# EAGLE design FHRM (EAGLE 9.5.2)
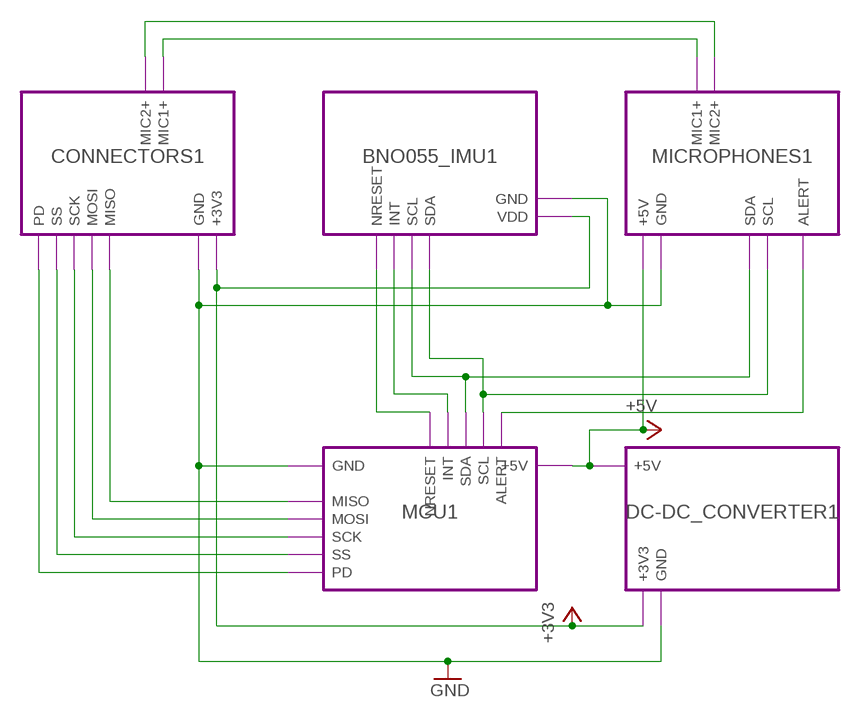
[diagram p0: schematic, sheet 1]

## Module instances
MCU1 = MCU
BNO055_IMU1 = BNO055_IMU
DC-DC_CONVERTER1 = DC-DC_CONVERTER
MICROPHONES1 = MICROPHONE
CONNECTORS1 = CONNECTORS

## Nets
+3V3: port CONNECTORS1.+3V3 BNO055_IMU1.VDD DC-DC_CONVERTER1.+3V3
+5V: port MCU1.+5V DC-DC_CONVERTER1.+5V MICROPHONES1.+5V
GND: port CONNECTORS1.GND BNO055_IMU1.GND MCU1.GND DC-DC_CONVERTER1.GND MICROPHONES1.GND
N$3: port CONNECTORS1.MISO MCU1.MISO
N$4: port CONNECTORS1.MOSI MCU1.MOSI
N$5: port CONNECTORS1.SCK MCU1.SCK
N$6: port CONNECTORS1.SS MCU1.SS
N$7: port CONNECTORS1.PD MCU1.PD
N$8: port CONNECTORS1.MIC1+ MICROPHONES1.MIC1+
N$9: port CONNECTORS1.MIC2+ MICROPHONES1.MIC2+
N$11: port MCU1.ALERT MICROPHONES1.ALERT
N$12: port MCU1.SCL MICROPHONES1.SCL BNO055_IMU1.SDA
N$13: port MCU1.SDA MICROPHONES1.SDA BNO055_IMU1.SCL
N$14: port MCU1.INT BNO055_IMU1.INT
N$15: port MCU1.NRESET BNO055_IMU1.NRESET

## Library data of the parts

## Module MCU
Ports: +5V(pwr) GND(pwr) SCL(io) SDA(io) ALERT(io) INT(io) NRESET(io) MISO(io) MOSI(io) SCK(io) SS(io) PD(io)
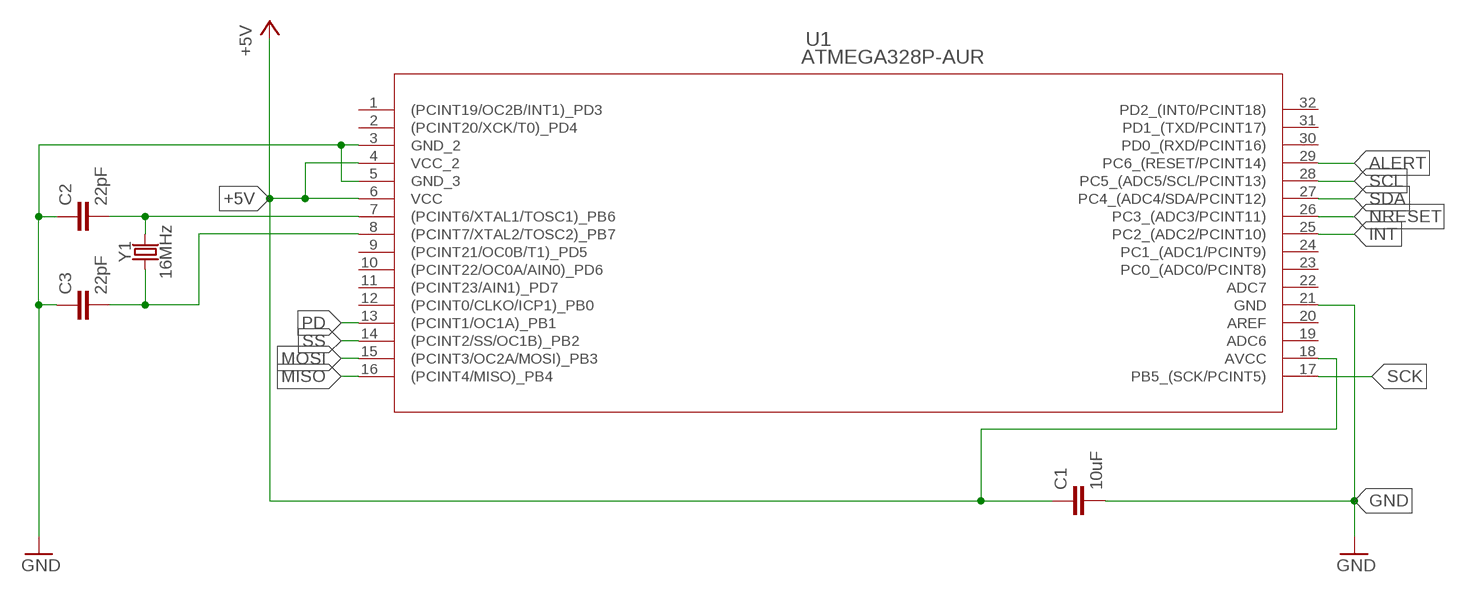
[diagram p1: schematic, module MCU, sheet 1]

### Parts
C1  10uF  10UF-0603-6.3V-20%  [0603]
C2  22pF  22PF-0603-50V-5%  [0603]
C3  22pF  22PF-0603-50V-5%  [0603]
U1  ATMEGA328P-AUR  [32A_ATM]
Y1  16MHz  CRYSTAL-16MHZSMD-5X3.2  [CRYSTAL-SMD-5X3.2-4PAD]

### Nets
+5V: C1.1 U1.4(VCC_2) U1.6(VCC) U1.18(AVCC)
ALERT: U1.29(PC6_(RESET/PCINT14))
GND: C1.2 C2.1 C3.1 U1.3(GND_2) U1.5(GND_3) U1.21(GND)
INT: U1.25(PC2_(ADC2/PCINT10))
MISO: U1.16((PCINT4/MISO)_PB4)
MOSI: U1.15((PCINT3/OC2A/MOSI)_PB3)
N$1: C2.2 U1.7((PCINT6/XTAL1/TOSC1)_PB6) Y1.3
N$2: C3.2 U1.8((PCINT7/XTAL2/TOSC2)_PB7) Y1.1
NRESET: U1.26(PC3_(ADC3/PCINT11))
PD: U1.13((PCINT1/OC1A)_PB1)
SCK: U1.17(PB5_(SCK/PCINT5))
SCL: U1.28(PC5_(ADC5/SCL/PCINT13))
SDA: U1.27(PC4_(ADC4/SDA/PCINT12))
SS: U1.14((PCINT2/SS/OC1B)_PB2)
Unconnected: U1.1((PCINT19/OC2B/INT1)_PD3) U1.2((PCINT20/XCK/T0)_PD4) U1.9((PCINT21/OC0B/T1)_PD5) U1.10((PCINT22/OC0A/AIN0)_PD6) U1.11((PCINT23/AIN1)_PD7) U1.12((PCINT0/CLKO/ICP1)_PB0) U1.19(ADC6) U1.20(AREF) U1.22(ADC7) U1.23(PC0_(ADC0/PCINT8)) U1.24(PC1_(ADC1/PCINT9)) U1.30(PD0_(RXD/PCINT16)) U1.31(PD1_(TXD/PCINT17)) U1.32(PD2_(INT0/PCINT18))

### Library data of the parts
C1 = SparkFun-Capacitors:10UF: 10.0µF ceramic capacitors A capacitor is a passive two-terminal electrical component used to store electrical energy temporarily in an electric field.; PROD_ID: CAP-11015
C2 C3 = SparkFun-Capacitors:22PF: 22pF ceramic capacitors A capacitor is a passive two-terminal electrical component used to store electrical energy temporarily in an electric field.; PROD_ID: CAP-07876
U1 = BME398_FetalHeartRate_Library:ATMEGA328P-AUR; BUILT_BY: EMA_UL_Team; MANUFACTURER_PART_NUMBER: ATMEGA328P-AUR; SOURCELIBRARY: Atmel_2014-06-19; VENDOR: Atmel
Y1 = SparkFun-Clocks:CRYSTAL-16MHZ: 16MHz Crystal Digikey Example <http://www.digikey.com/product-search/en?keywords=535-9122-1-ND> Frequency: 16MHz Frequency Stability: ±50ppm Frequency Tolerance: ±20ppm Load Capacitance: 18pF SparkFun Products: Pro Micro -5V/16MHz <https://www.sparkfun.com/products/12640> SparkFun Serial Enabled LCD Kit <https://www.sparkfun.com/products/10097>; PROD_ID: XTAL-08218; SF_ID: COM-00094

## Module BNO055_IMU
Ports: VDD(pwr) GND(pwr) SCL(io) SDA(io) NRESET(io) INT(io)
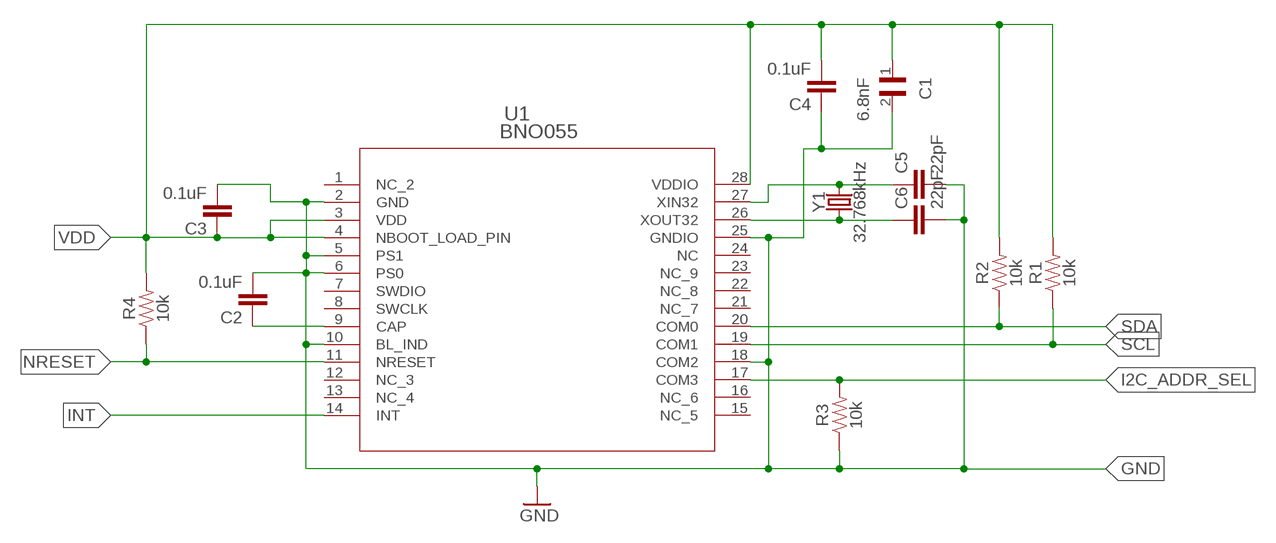
[diagram p2: schematic, module BNO055_IMU, sheet 1]

### Parts
C1  6.8nF  C0805X682J5GECAUTO7210  [CAPC2012X140N]
C2  0.1uF  0.1UF-0603-25V-(+80/-20%)  [0603]
C3  0.1uF  0.1UF-0603-25V-(+80/-20%)  [0603]
C4  0.1uF  0.1UF-0603-25V-(+80/-20%)  [0603]
C5  22pF  22PF-0603-50V-5%  [0603]
C6  22pF  22PF-0603-50V-5%  [0603]
R1  10k  10KOHM-0603-1/10W-1%  [0603]
R2  10k  10KOHM-0603-1/10W-1%  [0603]
R3  10k  10KOHM-0603-1/10W-1%  [0603]
R4  10k  10KOHM-0603-1/10W-1%  [0603]
U1  BNO055  [QFN_BNO055_BOS]
Y1  32.768kHz  CRYSTAL-32.768KHZSMD-3.2X1.5  [CRYSTAL-SMD-3.2X1.5MM]

### Nets
GND: C1.2 C2.2 C3.2 C4.1 C5.2 C6.2 R3.1 U1.2(GND) U1.5(PS1) U1.6(PS0) U1.10(BL_IND) U1.18(COM2) U1.25(GNDIO)
I2C_ADDR_SEL: R3.2 U1.17(COM3)
INT: U1.14(INT)
N$1: C5.1 U1.27(XIN32) Y1.P$2
N$2: C2.1 U1.9(CAP)
N$3: C6.1 U1.26(XOUT32) Y1.P$1
NRESET: R4.1 U1.11(NRESET)
SCL: R1.1 U1.19(COM1)
SDA: R2.1 U1.20(COM0)
VDD: C1.1 C3.1 C4.2 R1.2 R2.2 R4.2 U1.3(VDD) U1.4(NBOOT_LOAD_PIN) U1.28(VDDIO)
Unconnected: U1.1(NC_2) U1.7(SWDIO) U1.8(SWCLK) U1.12(NC_3) U1.13(NC_4) U1.15(NC_5) U1.16(NC_6) U1.21(NC_7) U1.22(NC_8) U1.23(NC_9) U1.24(NC)

### Library data of the parts
C1 = BME398_FetalHeartRate_Library:C0805X682J5GECAUTO7210; DESCRIPTION: 6800pF ±5% 50V Ceramic Capacitor C0G, NP0 0805 (2012 Metric); DIGI-KEY_PART_NUMBER: C0805X682J5GECAUTO7210-ND; MF: KEMET; MP: C0805X682J5GECAUTO7210; PACKAGE: 2012 KEMET
C2-C4 = SparkFun-Capacitors:0.1UF: 0.1µF ceramic capacitors A capacitor is a passive two-terminal electrical component used to store electrical energy temporarily in an electric field.; PROD_ID: CAP-00810
C5 C6 = SparkFun-Capacitors:22PF: 22pF ceramic capacitors A capacitor is a passive two-terminal electrical component used to store electrical energy temporarily in an electric field.; PROD_ID: CAP-07876
R1-R4 = SparkFun-Resistors:10KOHM: 10kΩ resistor A resistor is a passive two-terminal electrical component that implements electrical resistance as a circuit element. Resistors act to reduce current flow, and, at the same time, act to lower voltage levels within circuits. - Wikipedia; PROD_ID: RES-00824
U1 = BME398_FetalHeartRate_Library:BNO055; BUILT_BY: EMA_Matt; COPYRIGHT: Copyright (C) 2018 Accelerated Designs. All rights reserved; DATASHEET: https://www.bosch-sensortec.com/media/boschsensortec/downloads/datasheets/bst-bno055-ds000.pdf; MANUFACTURER_PART_NUMBER: BNO055; SOURCELIBRARY: Bosch_2019-11-06; VENDOR: Bosch
Y1 = SparkFun-Clocks:CRYSTAL-32.768KHZ: 32.768kHz Crystal Frequency: 32.768kHz Frequency Stability: ±20ppm Load Capacitance: 12.5pF (PTH-2X6 & SMD-3.2X1.5), 6pF (SMD-2X6) SparkFun Products: SparkFun BigTime Watch Kit <https://www.sparkfun.com/products/11734> SparkFun nRF52832 Breakout <https://www.sparkfun.com/products/13990> SparkFun Real Time Clock Module <https://www.sparkfun.com/products/12708>; PROD_ID: XTAL-13062

## Module DC-DC_CONVERTER
Ports: +5V(pwr) +3V3(pwr) GND(pwr)
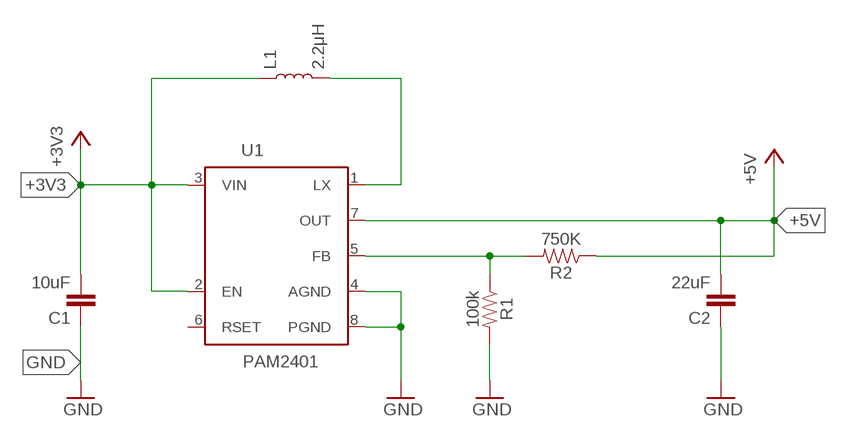
[diagram p3: schematic, module DC-DC_CONVERTER, sheet 1]

### Parts
C1  10uF  10UF-0603-6.3V-20%  [0603]
C2  22uF  22UF-0603-6.3V-20%  [0603]
L1  2.2μH  2.2μH-0805_WIDE-2.2μH-1.7A-0.14OHM  [0805-WIDE]
R1  100k  100KOHM-0603-1/10W-1%  [0603]
R2  750K  750KOHM-0603-1/10W-1%  [0603]
U1  PAM2401  [MSOP8]

### Nets
+3V3: C1.2 L1.1 U1.2(EN) U1.3(VIN)
+5V: C2.2 R2.1 U1.7(OUT)
GND: C1.1 C2.1 R1.2 U1.4(AGND) U1.8(PGND)
N$1: L1.2 U1.1(LX)
N$2: R1.1 R2.2 U1.5(FB)
Unconnected: U1.6(RSET)

### Library data of the parts
C1 = SparkFun-Capacitors:10UF: 10.0µF ceramic capacitors A capacitor is a passive two-terminal electrical component used to store electrical energy temporarily in an electric field.; PROD_ID: CAP-11015
C2 = SparkFun-Capacitors:22UF: 22µF ceramic capacitors A capacitor is a passive two-terminal electrical component used to store electrical energy temporarily in an electric field.; PROD_ID: CAP-14464
L1 = SparkFun-Coils:2.2μH: 2.2μH Inductor Resist changes in electrical current. Basically a coil of wire. SparkFun Products: SparkFun Edge - HX711 <https://www.sparkfun.com/products/15170>; PROD_ID: NDUC-14234
R1 = SparkFun-Resistors:100KOHM: 100kΩ resistor A resistor is a passive two-terminal electrical component that implements electrical resistance as a circuit element. Resistors act to reduce current flow, and, at the same time, act to lower voltage levels within circuits. - Wikipedia; PROD_ID: RES-07828
R2 = SparkFun-Resistors:750KOHM: 750Ω resistor A resistor is a passive two-terminal electrical component that implements electrical resistance as a circuit element. Resistors act to reduce current flow, and, at the same time, act to lower voltage levels within circuits. - Wikipedia; PROD_ID: RES-13768
U1 = SparkFun-IC-Power:PAM2401: PAM2401 - Boost PMIC Specifications: Up to 1A output current 0.9V to 4.75V Input Range 2.5V to 5.0V Adjustable Output Voltage Datasheet <https://www.diodes.com/assets/Datasheets/PAM2401.pdf> (Diodes inc.); PROD_ID: IC-13769

## Module MICROPHONE
Ports: +5V(pwr) GND(pwr) MIC1+(io) MIC2+(io) ALERT(io) SCL(io) SDA(io)
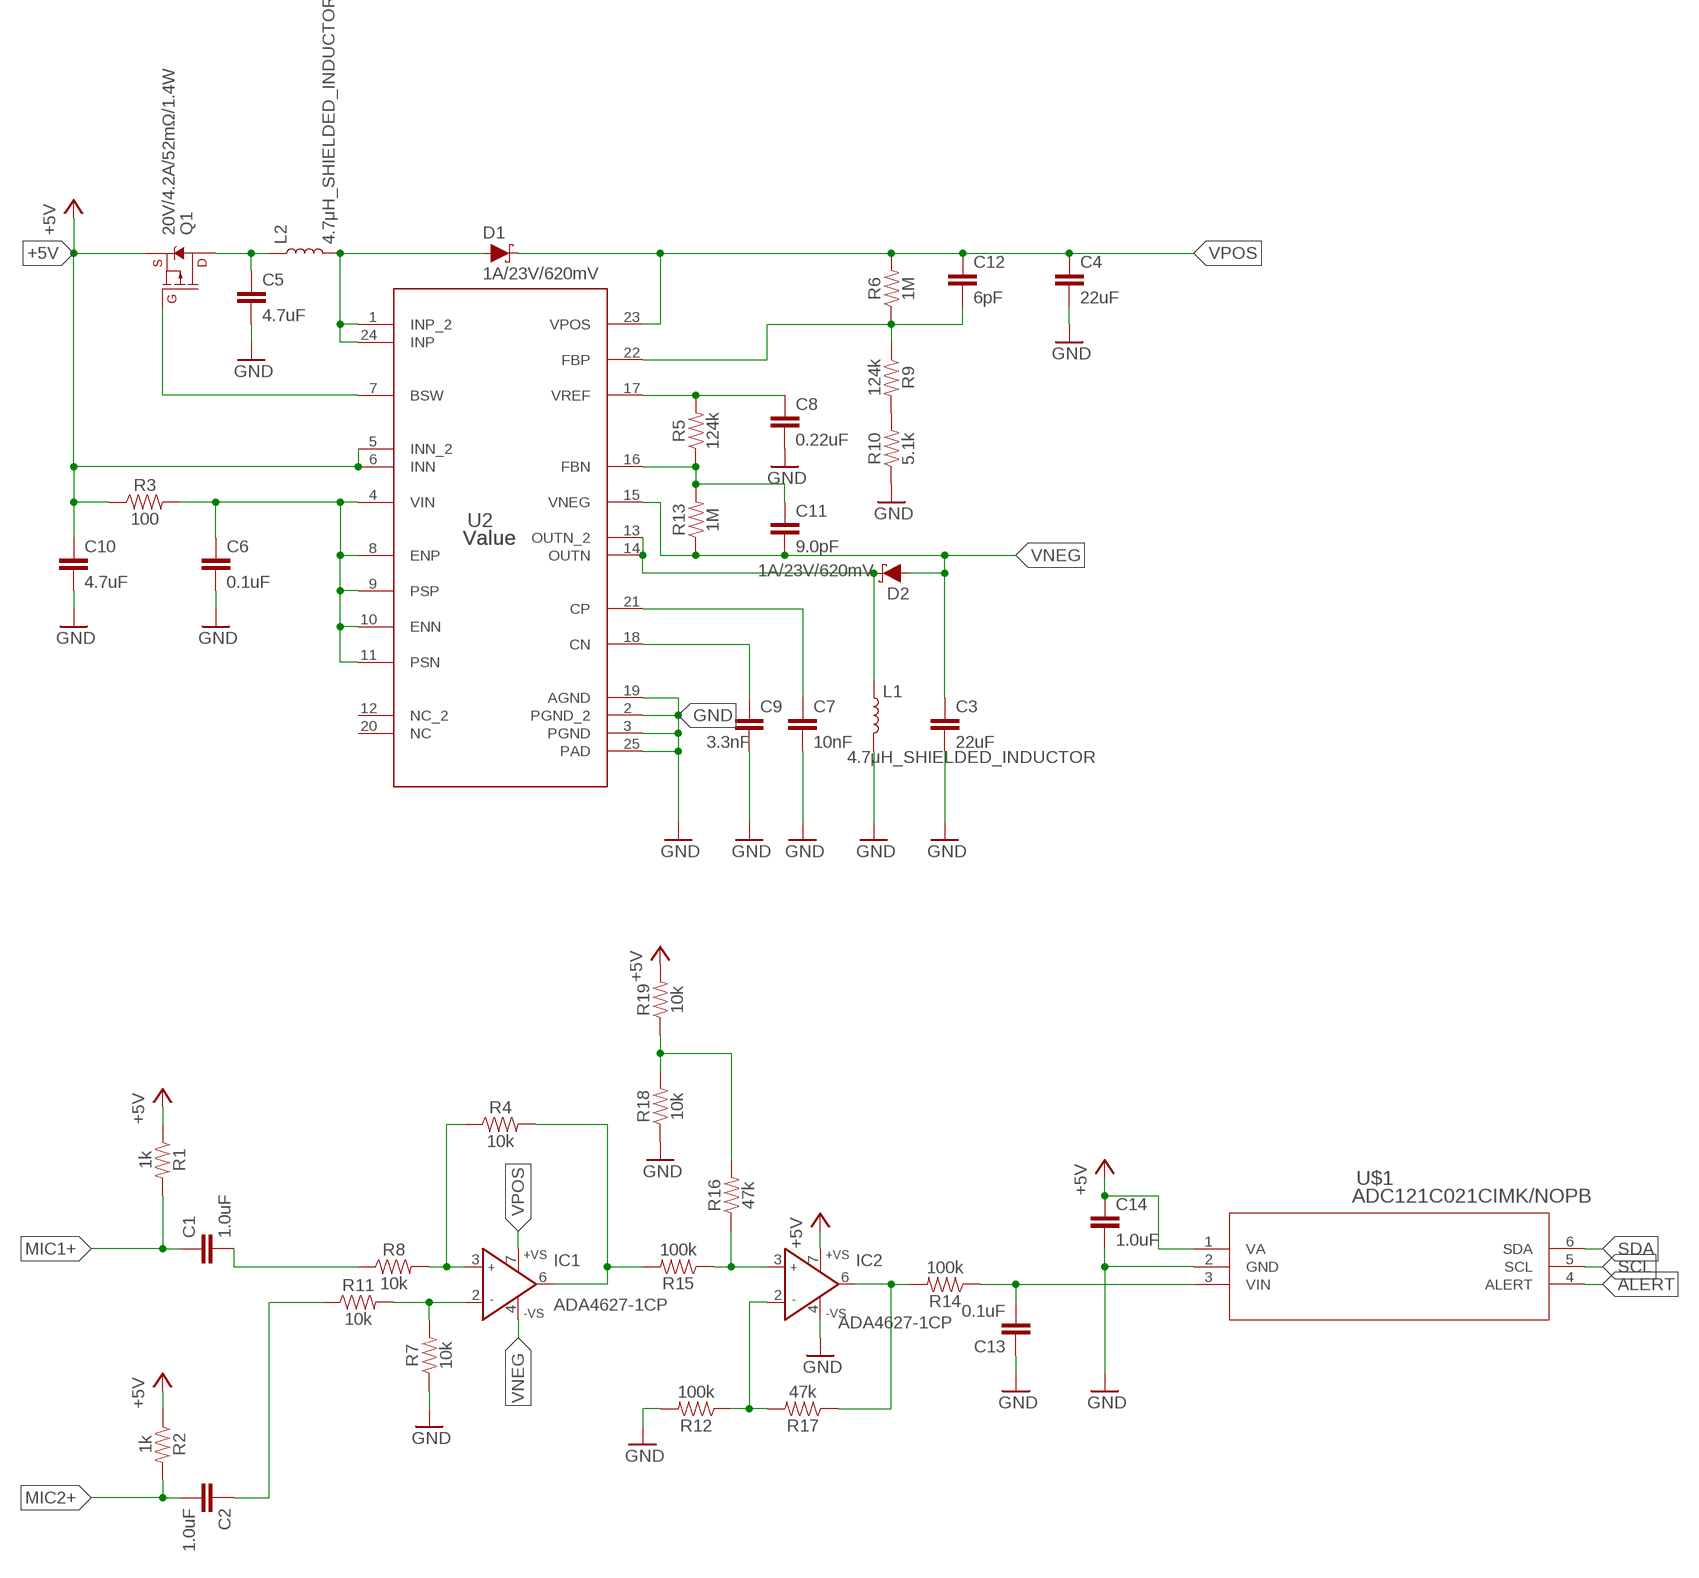
[diagram p4: schematic, module MICROPHONE, sheet 1]

### Parts
C1  1.0uF  1.0UF-0603-16V-10%  [0603]
C2  1.0uF  1.0UF-0603-16V-10%  [0603]
C3  22uF  22UF-0805-16V-20%  [0805]
C4  22uF  22UF-0805-16V-20%  [0805]
C5  4.7uF  4.7UF-0603-6.3V-(10%)  [0603]
C6  0.1uF  0.1UF-0603-25V-(+80/-20%)  [0603]
C7  10nF  10NF-0603-50V-10%  [0603]
C8  0.22uF  0.22UF-0603-25V-10%  [0603]
C9  3.3nF  3.3NF-0603-100V-10%  [0603]
C10  4.7uF  4.7UF-0603-6.3V-(10%)  [0603]
C11  9.0pF  9.0PF-0603-50V-10%  [0603]
C12  6pF  6PF-0402-50V-0.5%  [0402]
C13  0.1uF  0.1UF-0603-25V-(+80/-20%)  [0603]
C14  1.0uF  1.0UF-0603-16V-10%  [0603]
D1  1A/23V/620mV  DIODE-SCHOTTKY-BAT20J  [SOD-323]
D2  1A/23V/620mV  DIODE-SCHOTTKY-BAT20J  [SOD-323]
IC1  ADA4627-1CP  [LFCSP8]
IC2  ADA4627-1CP  [LFCSP8]
L1  4.7μH_SHIELDED_INDUCTOR  [1008(2520)]
L2  4.7μH_SHIELDED_INDUCTOR  [1008(2520)]
Q1  20V/4.2A/52mΩ/1.4W  MOSFET_PCH-DMG2305UX-7  [SOT23-3]
R1  1k  1KOHM-0603-1/10W-1%  [0603]
R2  1k  1KOHM-0603-1/10W-1%  [0603]
R3  100  100OHM-0603-1/10W-1%  [0603]
R4  10k  10KOHM-0603-1/10W-1%  [0603]
R5  124k  124KOHM  [0603]
R6  1M  1MOHM-0603-1/4W-5%  [0603]
R7  10k  10KOHM-0603-1/10W-1%  [0603]
R8  10k  10KOHM-0603-1/10W-1%  [0603]
R9  124k  124KOHM  [0603]
R10  5.1k  5.1KOHM5.1KOHM-0603-1/10W-1%  [0603]
R11  10k  10KOHM-0603-1/10W-1%  [0603]
R12  100k  100KOHM-0603-1/10W-1%  [0603]
R13  1M  1MOHM-0603-1/4W-5%  [0603]
R14  100k  100KOHM-0603-1/10W-1%  [0603]
R15  100k  100KOHM-0603-1/10W-1%  [0603]
R16  47k  47KOHM-0603-1/10W-1%  [0603]
R17  47k  47KOHM-0603-1/10W-1%  [0603]
R18  10k  10KOHM-0603-1/10W-1%  [0603]
R19  10k  10KOHM-0603-1/10W-1%  [0603]
U2  Value  TPS65130RGER  [RGE0024B]
U$1  ADC121C021CIMK/NOPB  [MK06A]

### Nets
+5V: C10.1 C14.1 IC2.7(+VS) Q1.2(S) R1.1 R2.1 R3.1 R19.2 U2.5(INN_2) U2.6(INN) U$1.1(VA)
ALERT: U$1.4(ALERT)
GND: C3.2 C4.2 C5.2 C6.2 C7.2 C8.2 C9.2 C10.2 C13.1 C14.2 IC2.4(-VS) L1.2 R7.1 R10.1 R12.2 R18.1 U2.2(PGND_2) U2.3(PGND) U2.19(AGND) U2.25(PAD) U$1.2(GND)
MIC1+: C1.1 R1.2
MIC2+: C2.2 R2.2
N$1: C6.1 R3.2 U2.4(VIN) U2.8(ENP) U2.9(PSP) U2.10(ENN) U2.11(PSN)
N$2: C7.1 U2.21(CP)
N$3: C9.1 U2.18(CN)
N$4: Q1.1(G) U2.7(BSW)
N$5: C5.1 L2.1 Q1.3(D)
N$6: D1.A L2.2 U2.1(INP_2) U2.24(INP)
N$7: IC2.3(IN+) R15.1 R16.1
N$8: C8.1 R5.2 U2.17(VREF)
N$9: C11.1 R5.1 R13.2 U2.16(FBN)
N$10: IC2.2(IN-) R12.1 R17.2
N$11: D2.C L1.1 U2.13(OUTN_2) U2.14(OUTN)
N$12: R9.2 R10.2
N$13: C12.2 R6.1 R9.1 U2.22(FBP)
N$14: C1.2 R8.1
N$15: C2.1 R11.1
N$16: IC1.2(IN-) R7.2 R11.2
N$17: IC1.3(IN+) R4.1 R8.2
N$18: IC1.6(OUT) R4.2 R15.2
N$19: IC2.6(OUT) R14.2 R17.1
N$20: C13.2 R14.1 U$1.3(VIN)
N$21: R16.2 R18.2 R19.1
SCL: U$1.5(SCL)
SDA: U$1.6(SDA)
VNEG: C3.1 C11.2 D2.A IC1.4(-VS) R13.1 U2.15(VNEG)
VPOS: C4.1 C12.1 D1.C IC1.7(+VS) R6.2 U2.23(VPOS)
Unconnected: U2.12(NC_2) U2.20(NC)

### Library data of the parts
C1 C2 C14 = SparkFun-Capacitors:1.0UF: 1µF ceramic capacitors A capacitor is a passive two-terminal electrical component used to store electrical energy temporarily in an electric field.; PROD_ID: CAP-00868
C3 C4 = SparkFun-Capacitors:22UF: 22µF ceramic capacitors A capacitor is a passive two-terminal electrical component used to store electrical energy temporarily in an electric field.; PROD_ID: CAP-14260
C5 C10 = SparkFun-Capacitors:4.7UF: 4.7µF ceramic capacitors A capacitor is a passive two-terminal electrical component used to store electrical energy temporarily in an electric field.; PROD_ID: CAP-08280
C6 C13 = SparkFun-Capacitors:0.1UF: 0.1µF ceramic capacitors A capacitor is a passive two-terminal electrical component used to store electrical energy temporarily in an electric field.; PROD_ID: CAP-00810
C7 = SparkFun-Capacitors:10NF: 0.01uF/10nF/10,000pF ceramic capacitors A capacitor is a passive two-terminal electrical component used to store electrical energy temporarily in an electric field. CAP-09321; PROD_ID: CAP-00867
C8 = SparkFun-Capacitors:0.22UF: 0.22µF ceramic capacitors A capacitor is a passive two-terminal electrical component used to store electrical energy temporarily in an electric field.; PROD_ID: CAP-07822
C9 = SparkFun-Capacitors:3.3NF: 3.3nF ceramic capacitors A capacitor is a passive two-terminal electrical component used to store electrical energy temporarily in an electric field.; PROD_ID: CAP-09633
C11 = SparkFun-Capacitors:9.0PF: 9.0pF ceramic capacitors A capacitor is a passive two-terminal electrical component used to store electrical energy temporarily in an electric field.; PROD_ID: CAP-09341
C12 = SparkFun-Capacitors:6PF: 6pF ceramic capacitors A capacitor is a passive two-terminal electrical component used to store electrical energy temporarily in an electric field.; PROD_ID: CAP-13455
D1 D2 = SparkFun-DiscreteSemi:DIODE-SCHOTTKY: Schottky diode A Schottky diode is a semiconductor diode which has a low forward voltage drop and a very fast switching action.; PROD_ID: DIO-11623
IC1 IC2 = analog-devices:ADA4627-1CP: 36 V, 19 MHz, Low Noise, Low Bias Current, JFET Operational Amplifier Source: http://www.analog.com/static/imported-files/data_sheets/ADA4627-1.pdf; MPN: ADA4627-1ACPZ-R2; OC_FARNELL: 1827379; OC_NEWARK: 80R8148
L1 L2 = SparkFun-Coils:4.7μH_SHIELDED_INDUCTOR: 4.7uH Inductor 4.7uH 1.4A 50mOhm 1008(2520) Package Shielded; PROD_ID: NDUC-14880
Q1 = SparkFun-DiscreteSemi:MOSFET_PCH: P-channel MOSFETs Voltage controlled devices that allow control of high current outputs. SparkFun Products: SparkFun ESP32 Thing <https://www.sparkfun.com/products/13907> SparkFun ESP8266 Thing <https://www.sparkfun.com/products/13231> SparkFun Pi Servo HAT V2 <https://www.sparkfun.com/products/15316> DMG2305UX-7 (20V/4.2A/SOT23-3); PROD_ID: TRAN-14388
R1 R2 = SparkFun-Resistors:1KOHM: 1kΩ resistor A resistor is a passive two-terminal electrical component that implements electrical resistance as a circuit element. Resistors act to reduce current flow, and, at the same time, act to lower voltage levels within circuits. - Wikipedia; PROD_ID: RES-07856
R3 = SparkFun-Resistors:100OHM: 100Ω resistor A resistor is a passive two-terminal electrical component that implements electrical resistance as a circuit element. Resistors act to reduce current flow, and, at the same time, act to lower voltage levels within circuits. - Wikipedia; PROD_ID: RES-07863
R4 R7 R8 R11 R18 R19 = SparkFun-Resistors:10KOHM: 10kΩ resistor A resistor is a passive two-terminal electrical component that implements electrical resistance as a circuit element. Resistors act to reduce current flow, and, at the same time, act to lower voltage levels within circuits. - Wikipedia; PROD_ID: RES-00824
R5 R9 = SparkFun-Resistors:124KOHM: 124kΩ resistor A resistor is a passive two-terminal electrical component that implements electrical resistance as a circuit element. Resistors act to reduce current flow, and, at the same time, act to lower voltage levels within circuits. - Wikipedia; PROD_ID: RES-14395
R6 R13 = SparkFun-Resistors:1MOHM: 1MΩ resistor A resistor is a passive two-terminal electrical component that implements electrical resistance as a circuit element. Resistors act to reduce current flow, and, at the same time, act to lower voltage levels within circuits. - Wikipedia; PROD_ID: RES-07868
R10 = SparkFun-Resistors:5.1KOHM; PROD_ID: RES-12083
R12 R14 R15 = SparkFun-Resistors:100KOHM: 100kΩ resistor A resistor is a passive two-terminal electrical component that implements electrical resistance as a circuit element. Resistors act to reduce current flow, and, at the same time, act to lower voltage levels within circuits. - Wikipedia; PROD_ID: RES-07828
R16 R17 = SparkFun-Resistors:47KOHM: 47kΩ resistor A resistor is a passive two-terminal electrical component that implements electrical resistance as a circuit element. Resistors act to reduce current flow, and, at the same time, act to lower voltage levels within circuits. - Wikipedia; PROD_ID: RES-07871
U2 = BME398_FetalHeartRate_Library:TPS65130RGER; ALTERNATE_PARTNUMBER: TPS65130RGET; APPLICATION_BUILDNUMBER: *; COMPTYPE: IC; MANUFACTURER: Texas Instruments; MOUNTTYPE: SMT; PACKAGEREFERENCE: RGE0024B; PARTNUMBER: TPS65130RGER; PIN_COUNT: 25; REFDES: RefDes; ROHS: Y; TYPE: TYPE
U$1 = BME398_FetalHeartRate_Library:ADC121C021CIMK/NOPB; MANUFACTURER_PART_NUMBER: ADC121C021CIMK/NOPB; VENDOR: National

## Module CONNECTORS
Ports: +3V3(pwr) GND(pwr) MIC1+(io) MIC2+(io) MISO(io) MOSI(io) SCK(io) SS(io) PD(io)
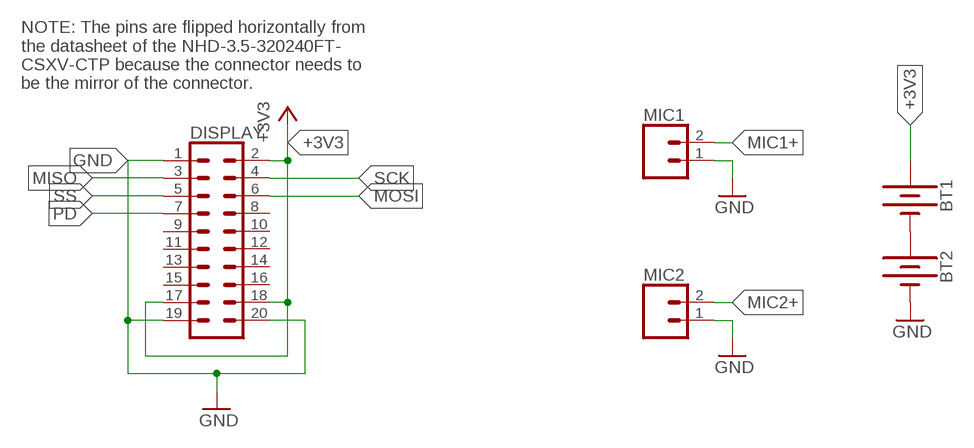
[diagram p5: schematic, module CONNECTORS, sheet 1]

### Parts
BT1  BATTERY-AA  [BATTERY-AA]
BT2  BATTERY-AA  [BATTERY-AA]
DISPLAY  CONN_10X2  [2X10]
MIC1  CONN_02JST-PTH-2  [JST-2-PTH]
MIC2  CONN_02JST-PTH-2  [JST-2-PTH]

### Nets
+3V3: BT1.PWR@1(+) DISPLAY.2 DISPLAY.17 DISPLAY.18
GND: BT2.GND@1(-) DISPLAY.1 DISPLAY.19 DISPLAY.20 MIC1.1 MIC2.1
MIC1+: MIC1.2
MIC2+: MIC2.2
MISO: DISPLAY.3
MOSI: DISPLAY.6
N$1: BT1.GND@1(-) BT2.PWR@1(+)
PD: DISPLAY.7
SCK: DISPLAY.4
SS: DISPLAY.5
Unconnected: DISPLAY.8 DISPLAY.9 DISPLAY.10 DISPLAY.11 DISPLAY.12 DISPLAY.13 DISPLAY.14 DISPLAY.15 DISPLAY.16

### Notes on the sheet
- NOTE: The pins are flipped horizontally from
  the datasheet of the NHD-3.5-320240FT-
  CSXV-CTP because the connector needs to 
  be the mirror of the connector.

### Library data of the parts
BT1 BT2 = SparkFun-Batteries:BATTERY: Battery - Single Cell A variety of battery chemistries, sizes, and footprints. Device List: 20MM_PTH - Coin Cell Battery Holder - 20mm (PTH) <https://www.sparkfun.com/products/783> 20MM_PTH_KIT- Coin Cell battery Holder - 20 mm (PTH) <http://www.sparkfun.com/products/783>kit version with special mask 6.8MM_PTH - Coin Cell Battery Holder - 6.8MM(SMD) <https://www.digikey.com/product-detail/en/seiko-instruments/MS621FE-FL11E/728-1057-ND/1889208?WT.srch=1&gclid=CNOQ5a6LzdQCFZS2wAodXCkE0g> 12MM_SMD - Coin Cell Battery Holder - 12mm (SMD) <https://www.sparkfun.com/products/10592> 12MM_PTH - Coin Cell Battery Holder - 12mm (PTH) <https://www.sparkfun.com/products/7948> 20MM_SMD - 20mm Coin Cell Battery Holder (SMD) (2 legs) Used on the Big Time Watch Kit <https://www.sparkfun.com/products/11734> 20MM_SMD_4LEGS - Coin Cell Battery Holder - 20mm (SMD) <https://www.sparkfun.com/products/11892> 20MM_SMD_4LEGS_OVERPASTE - Coin Cell Battery Holder - 20mm (SMD) <https://www.sparkfun.com/products/11892> (Over-paste on the legs) 24.5MM_PTH - Coin Cell Battery Holder - 24.5mm (PTH) <https://www.sparkfun.com/products/8863> 9V - 9V Battery Holder - PC Mount Used on the SparkFun SparkPunk Sound Kit <https://www.sparkfun.com/products/11177> and SparkFun SparkPunk Sequencer Kit <https://www.sparkfun.com/products/12707> 18650 - Battery Holder - 18650 (PTH) <https://www.sparkfun.com/products/13113> AA - Battery Holder - 1xAA (PTH) <https://www.sparkfun.com/products/7949> AAA - Battery Holder - 1xAAA (PTH) <https://www.sparkfun.com/products/12718> AA_KIT - Battery Holder - 1xAA (PTH) <https://www.sparkfun.com/products/7949> Special kit package - pads only have exposed copper on one side of the board. AAA_KIT - Battery Holder - 1xAAA (PTH) <https://www.sparkfun.com/products/12718> Special kit package - pads only have exposed copper on one side of the board.; PROD_ID: BATT-08316; SF_SKU: PRT-07949
DISPLAY = SparkFun-Connectors:CONN_10X2: Multi connection point. Often used as Generic Header-pin footprint for 0.1 inch spaced/style header connections On any of the 0.1 inch spaced packages, you can populate with these: Break Away Headers - Straight <https://www.sparkfun.com/products/116> (PRT-00116) Break Away Male Headers - Right Angle <https://www.sparkfun.com/products/553> (PRT-00553) Female Headers <https://www.sparkfun.com/products/115> (PRT-00115) Break Away Headers - Machine Pin <https://www.sparkfun.com/products/117> (PRT-00117) Break Away Female Headers - Swiss Machine Pin <https://www.sparkfun.com/products/743> (PRT-00743) Special note about the "SPECIAL" package: This was SPECIALLY designed to be used with our Graphic LCD Backpack. Be sure you want to use this! It is not only staggered on each line of header holes, but IT IS ALSO offset of the center point of the top and bottom lines by 5 mil. This causes the headers to lock into place on the "standard" footprint on the LCD screen. The extra squares on the tdocu layer are there simply to reference other pins (if you were to actually populate a longer header than ten long - this is what we do with the backpacks).
MIC1 MIC2 = SparkFun-Connectors:CONN_02: Multi connection point. Often used as Generic Header-pin footprint for 0.1 inch spaced/style header connections On any of the 0.1 inch spaced packages, you can populate with these: Break Away Headers - Straight <https://www.sparkfun.com/products/116> (PRT-00116) Break Away Male Headers - Right Angle <https://www.sparkfun.com/products/553> (PRT-00553) Female Headers <https://www.sparkfun.com/products/115> (PRT-00115) Break Away Headers - Machine Pin <https://www.sparkfun.com/products/117> (PRT-00117) Break Away Female Headers - Swiss Machine Pin <https://www.sparkfun.com/products/743> (PRT-00743) For SCREWTERMINALS and SPRING TERMINALS visit here: Screw Terimnals on SparkFun.com <https://www.sparkfun.com/search/results?term=Screw+Terminals> (5mm/3.5mm/2.54mm spacing) This device is also useful as a general connection point to wire up your design to another part of your project. Our various solder wires solder well into these plated through hole pads. Hook-Up Wire - Assortment (Stranded, 22 AWG) <https://www.sparkfun.com/products/11375> (PRT-11375) Hook-Up Wire - Assortment (Solid Core, 22 AWG) <https://www.sparkfun.com/products/11367> (PRT-11367) View the entire wire category on our website here <https://www.sparkfun.com/categories/141> Special notes: Molex polarized connector foot print use with: PRT-08233 with associated crimp pins and housings. 2.54_SCREWTERM for use with PRT-10571. 3.5mm Screw Terminal footprints for PRT-08084 5mm Screw Terminal footprints for use with PRT-08432; PROD_ID: CONN-09863; SKU: PRT-09914

## Board
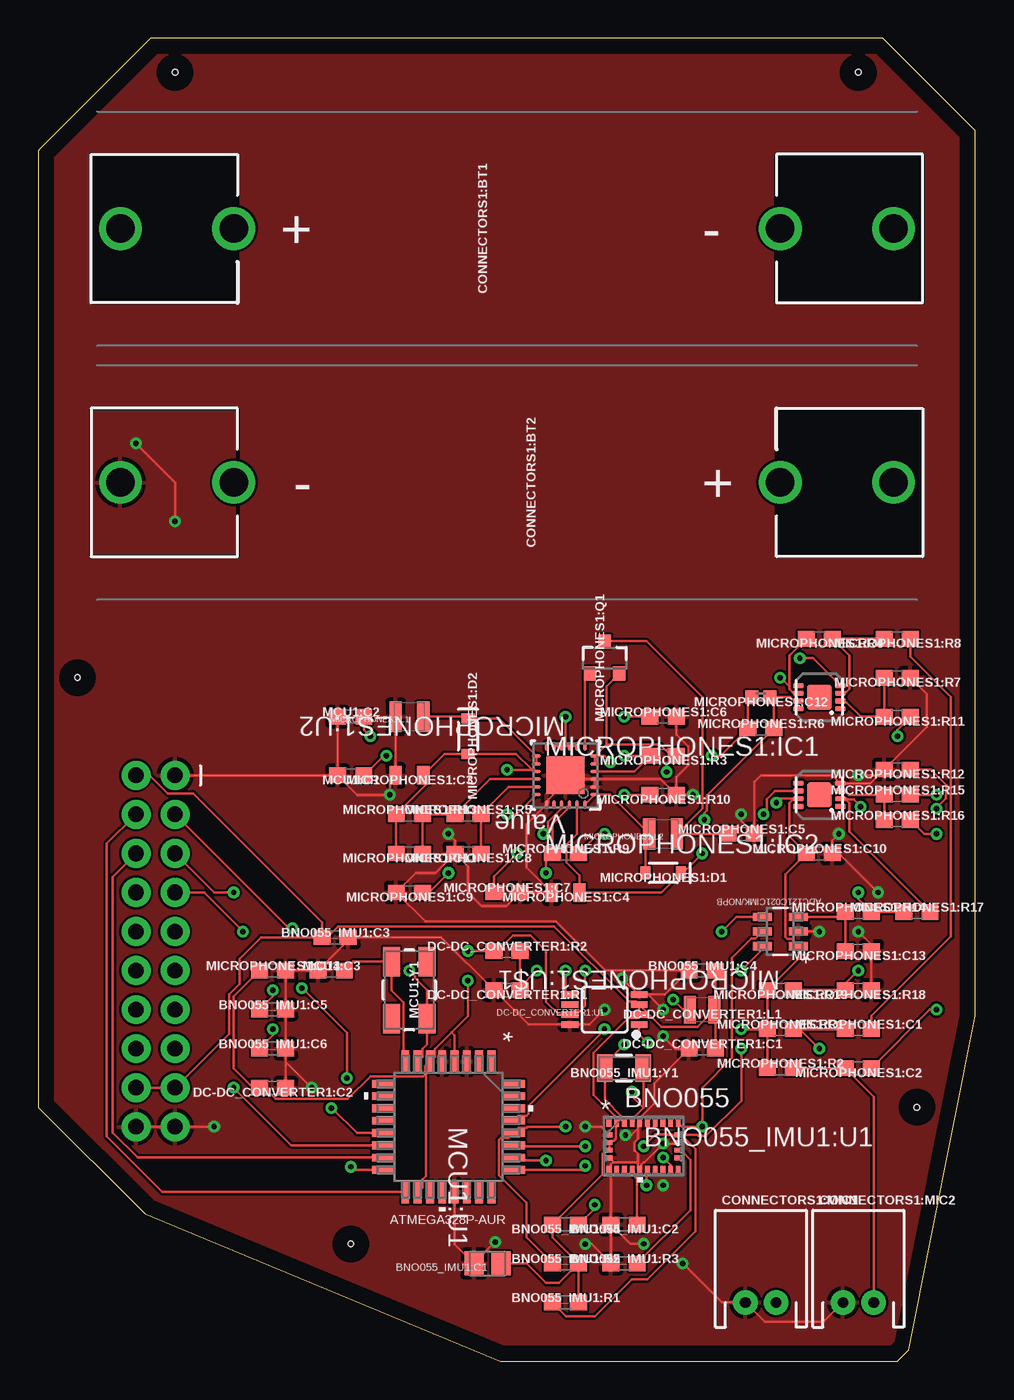
[diagram p6: board, top side]
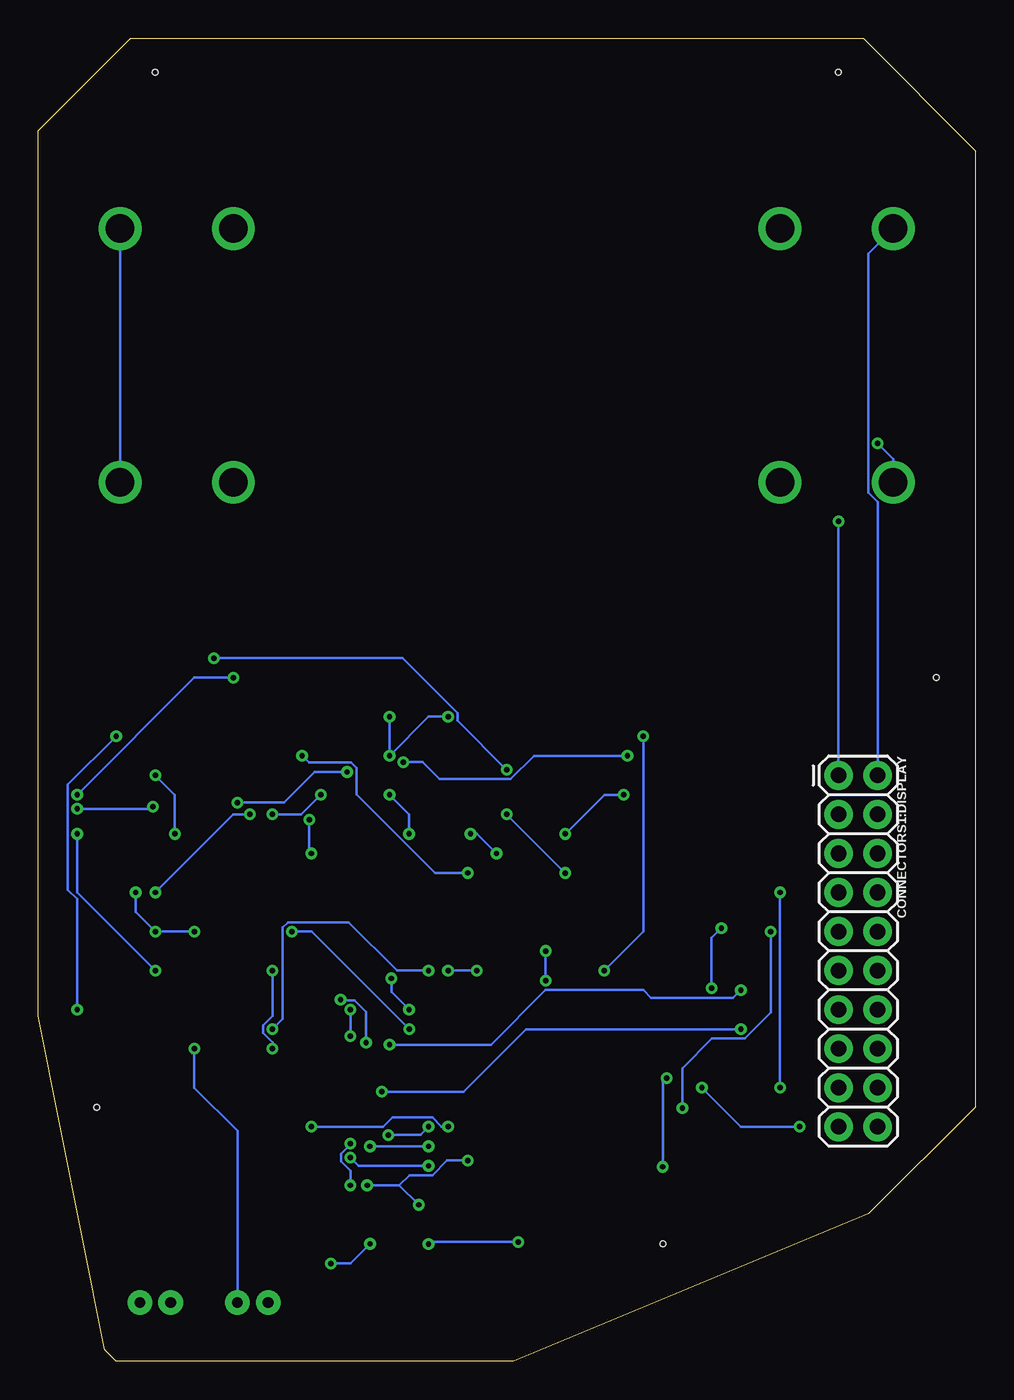
[diagram p7: board, bottom side, seen from below]

Size 60.94 x 86.03 mm. Coordinates in mm from the lower left corner, seen from the top.
Outline: 0,78.74 0,16.51 6.94,9.57 30.04,0 55.88,0 56.62,0.74 60.94,22.44 60.94,80.03 54.94,86.03 7.29,86.03 0,78.74
Copper layers (1*16): Top 0.035mm / dielectric 1.5mm / Bottom 0.035mm
Design rules "default *": minimum track width 6mil, minimum drill 0.35mm, track to track 6mil, track to pad 6mil, pad to pad 5mil, via to via 6mil, smd to smd 6mil, copper to edge 40mil, drill to drill 6mil, minimum pad ring 10mil, minimum via ring 8mil, stop-mask expansion 4mil, vias tented up to drill 0mil, thermal gap 10mil
Holes 0.35 mm at 8.89,83.82 53.34,83.82 20.32,7.62 57.15,16.51 2.54,44.45

### Footprints (pad centres in the part's own frame; a part is rotated, then mirrored left to right if it is on the bottom)
CAPC2012X140N = smd 1.24 x 1.56: 1 -0.885,0; 2 0.885,0
0603 = smd 1.1 x 1: 1 -0.85,0; 2 0.85,0
QFN_BNO055_BOS = smd 0.305 x 0.533: 1 -2.25,1.537; 6 -2.25,-1.537; 7 -1.75,-1.537; 8 -1.25,-1.537; 9 -0.75,-1.537; 10 -0.25,-1.537; 11 0.25,-1.537; 12 0.75,-1.537; 13 1.25,-1.537; 14 1.75,-1.537; 15 2.25,-1.537; 20 2.25,1.537; 21 1.75,1.537; 22 1.25,1.537; 23 0.75,1.537; 24 0.25,1.537; 25 -0.25,1.537; 26 -0.75,1.537; 27 -1.25,1.537; 28 -1.75,1.537 | smd 0.432 x 0.305: 2 -2.235,0.75; 3 -2.235,0.25; 4 -2.235,-0.25; 5 -2.235,-0.75; 16 2.235,-0.75; 17 2.235,-0.25; 18 2.235,0.25; 19 2.235,0.75
CRYSTAL-SMD-3.2X1.5MM = smd 1 x 1.8: P$1 -1.25,0; P$2 1.25,0
BATTERY-AA = drill 1.854: GND@1 25.146,0; GND@2 17.78,0; PWR@1 -25.146,0; PWR@2 -17.78,0
2X10 = drill 1.016 pad 1.88: 1 0,0; 2 0,2.54; 3 2.54,0; 4 2.54,2.54; 5 5.08,0; 6 5.08,2.54; 7 7.62,0; 8 7.62,2.54; 9 10.16,0; 10 10.16,2.54; 11 12.7,0; 12 12.7,2.54; 13 15.24,0; 14 15.24,2.54; 15 17.78,0; 16 17.78,2.54; 17 20.32,0; 18 20.32,2.54; 19 22.86,0; 20 22.86,2.54
JST-2-PTH = drill 0.7 pad 1.6: 1 -1,0; 2 1,0
0805-WIDE = smd 0.8 x 1.8: 1 -0.8,0; 2 0.8,0
MSOP8 = smd 0.4 x 1.1: 1 -0.975,-2.25; 2 -0.325,-2.25; 3 0.325,-2.25; 4 0.975,-2.25; 5 0.975,2.25; 6 0.325,2.25; 7 -0.325,2.25; 8 -0.975,2.25
32A_ATM = smd 1.473 x 0.508: 1 -4.242,2.8; 2 -4.242,2; 3 -4.242,1.2; 4 -4.242,0.4; 5 -4.242,-0.4; 6 -4.242,-1.2; 7 -4.242,-2; 8 -4.242,-2.8; 17 4.242,-2.8; 18 4.242,-2; 19 4.242,-1.2; 20 4.242,-0.4; 21 4.242,0.4; 22 4.242,1.2; 23 4.242,2; 24 4.242,2.8 | smd 0.508 x 1.473: 9 -2.8,-4.242; 10 -2,-4.242; 11 -1.2,-4.242; 12 -0.4,-4.242; 13 0.4,-4.242; 14 1.2,-4.242; 15 2,-4.242; 16 2.8,-4.242; 25 2.8,4.242; 26 2,4.242; 27 1.2,4.242; 28 0.4,4.242; 29 -0.4,4.242; 30 -1.2,4.242; 31 -2,4.242; 32 -2.8,4.242
CRYSTAL-SMD-5X3.2-4PAD = smd 1.9 x 1.1: 1 -1.85,-1.15; 2 1.85,-1.15; 3 1.85,1.15; 4 -1.85,1.15
0805 = smd 0.8 x 1.2: 1 -0.9,0; 2 0.9,0
0402 = smd 0.85 x 0.9: 1 -0.58,0; 2 0.58,0
SOD-323 = smd 0.63 x 0.83: A 1.15,0; C -1.15,0
LFCSP8 = smd 0.7 x 0.35: 1 -1.375,0.75; 2 -1.375,0.25; 3 -1.375,-0.25; 4 -1.375,-0.75; 5 1.375,-0.75; 6 1.375,-0.25; 7 1.375,0.25; 8 1.375,0.75 | smd 1.6 x 1.6: EXP 0,0
1008(2520) = smd 0.8 x 2: 1 -0.9,0; 2 0.9,0
SOT23-3 = smd 0.8 x 0.9: 1 -0.95,-1; 2 0.95,-1; 3 0,1.1
RGE0024B = smd 0.6 x 0.24: 1 -1.9,1.25; 2 -1.9,0.75; 3 -1.9,0.25; 4 -1.9,-0.25; 5 -1.9,-0.75; 6 -1.9,-1.25; 13 1.9,-1.25; 14 1.9,-0.75; 15 1.9,-0.25; 16 1.9,0.25; 17 1.9,0.75; 18 1.9,1.25 | smd 0.24 x 0.6: 7 -1.25,-1.9; 8 -0.75,-1.9; 9 -0.25,-1.9; 10 0.25,-1.9; 11 0.75,-1.9; 12 1.25,-1.9; 19 1.25,1.9; 20 0.75,1.9; 21 0.25,1.9; 22 -0.25,1.9; 23 -0.75,1.9; 24 -1.25,1.9 | smd 2.45 x 2.45: 25 0,0 | smd 0.5 x 0.5: V 0,-0.975
MK06A = smd 1.219 x 0.533: 1 -1.168,0.95; 2 -1.168,0; 3 -1.168,-0.95; 4 1.168,-0.95; 5 1.168,0; 6 1.168,0.95

### Placement (x,y rotation side)
BNO055_IMU1:C1  6.8nF  [CAPC2012X140N]  29.21,6.35 180 top
BNO055_IMU1:C2  0.1uF  [0603]  38.1,8.89 180 top
BNO055_IMU1:C3  0.1uF  [0603]  19.3,27.56 0 top
BNO055_IMU1:C4  0.1uF  [0603]  43.18,25.4 0 top
BNO055_IMU1:C5  22pF  [0603]  15.24,22.86 0 top
BNO055_IMU1:C6  22pF  [0603]  15.24,20.32 0 top
BNO055_IMU1:R1  10k  [0603]  34.29,3.81 0 top
BNO055_IMU1:R2  10k  [0603]  34.29,6.35 0 top
BNO055_IMU1:R3  10k  [0603]  38.1,6.35 0 top
BNO055_IMU1:R4  10k  [0603]  34.29,8.89 180 top
BNO055_IMU1:U1  BNO055  [QFN_BNO055_BOS]  39.37,13.97 0 top
BNO055_IMU1:Y1  32.768kHz  [CRYSTAL-SMD-3.2X1.5MM]  38.1,19.05 180 top
CONNECTORS1:BT1  [BATTERY-AA]  30.48,73.66 0 top
CONNECTORS1:BT2  [BATTERY-AA]  30.48,57.15 180 top
CONNECTORS1:DISPLAY  [2X10]  8.89,38.1 270 bottom
CONNECTORS1:MIC1  [JST-2-PTH]  46.99,3.81 0 top
CONNECTORS1:MIC2  [JST-2-PTH]  53.34,3.81 0 top
DC-DC_CONVERTER1:C1  10uF  [0603]  43.18,20.32 0 top
DC-DC_CONVERTER1:C2  22uF  [0603]  15.24,17.78 180 top
DC-DC_CONVERTER1:L1  2.2μH  [0805-WIDE]  43.18,22.86 180 top
DC-DC_CONVERTER1:R1  100k  [0603]  30.48,24.13 180 top
DC-DC_CONVERTER1:R2  750K  [0603]  30.48,26.67 0 top
DC-DC_CONVERTER1:U1  PAM2401  [MSOP8]  36.83,22.86 90 top
MCU1:C1  10uF  [0603]  20.32,38.1 180 top
MCU1:C2  22pF  [0603]  20.32,41.91 0 top
MCU1:C3  22pF  [0603]  19.05,25.4 0 top
MCU1:U1  ATMEGA328P-AUR  [32A_ATM]  26.67,15.24 270 top
MCU1:Y1  16MHz  [CRYSTAL-SMD-5X3.2-4PAD]  24.13,24.13 270 top
MICROPHONES1:C1  1.0uF  [0603]  53.34,21.59 0 top
MICROPHONES1:C2  1.0uF  [0603]  53.34,19.05 180 top
MICROPHONES1:C3  22uF  [0805]  24.13,38.1 180 top
MICROPHONES1:C4  22uF  [0805]  34.29,30.48 180 top
MICROPHONES1:C5  4.7uF  [0603]  45.72,34.29 0 top
MICROPHONES1:C6  0.1uF  [0603]  40.64,41.91 0 top
MICROPHONES1:C7  10nF  [0603]  30.48,30.48 0 top
MICROPHONES1:C8  0.22uF  [0603]  27.94,33.02 180 top
MICROPHONES1:C9  3.3nF  [0603]  24.13,30.48 180 top
MICROPHONES1:C10  4.7uF  [0603]  50.8,33.02 0 top
MICROPHONES1:C11  9.0pF  [0603]  24.13,33.02 180 top
MICROPHONES1:C12  6pF  [0402]  46.99,43.18 180 top
MICROPHONES1:C13  0.1uF  [0603]  53.34,26.67 180 top
MICROPHONES1:C14  1.0uF  [0603]  15.24,25.4 0 top
MICROPHONES1:D1  1A/23V/620mV  [SOD-323]  40.64,31.75 180 top
MICROPHONES1:D2  1A/23V/620mV  [SOD-323]  27.94,40.64 270 top
MICROPHONES1:IC1  ADA4627-1CP  [LFCSP8]  50.8,43.18 180 top
MICROPHONES1:IC2  ADA4627-1CP  [LFCSP8]  50.8,36.83 180 top
MICROPHONES1:L1  4.7μH_SHIELDED_INDUCTOR  [1008(2520)]  24.13,41.91 180 top
MICROPHONES1:L2  4.7μH_SHIELDED_INDUCTOR  [1008(2520)]  40.64,34.29 180 top
MICROPHONES1:Q1  20V/4.2A/52mΩ/1.4W  [SOT23-3]  36.83,45.72 0 top
MICROPHONES1:R1  1k  [0603]  48.26,21.59 0 top
MICROPHONES1:R2  1k  [0603]  48.26,19.05 0 top
MICROPHONES1:R3  100  [0603]  40.64,39.37 180 top
MICROPHONES1:R4  10k  [0603]  50.8,46.99 180 top
MICROPHONES1:R5  124k  [0603]  27.94,35.56 0 top
MICROPHONES1:R6  1M  [0603]  46.99,41.15 0 top
MICROPHONES1:R7  10k  [0603]  55.88,44.45 180 top
MICROPHONES1:R8  10k  [0603]  55.88,46.99 180 top
MICROPHONES1:R9  124k  [0603]  34.29,33.02 0 top
MICROPHONES1:R10  5.1k  [0603]  40.64,36.83 180 top
MICROPHONES1:R11  10k  [0603]  55.88,41.91 180 top
MICROPHONES1:R12  100k  [0603]  55.88,38.48 180 top
MICROPHONES1:R13  1M  [0603]  24.13,35.56 0 top
MICROPHONES1:R14  100k  [0603]  53.34,29.21 0 top
MICROPHONES1:R15  100k  [0603]  55.88,36.83 0 top
MICROPHONES1:R16  47k  [0603]  55.88,35.18 0 top
MICROPHONES1:R17  47k  [0603]  57.15,29.21 0 top
MICROPHONES1:R18  10k  [0603]  53.34,24.13 180 top
MICROPHONES1:R19  10k  [0603]  48.26,24.13 180 top
MICROPHONES1:U2  Value  [RGE0024B]  34.29,38.1 180 top
MICROPHONES1:U$1  ADC121C021CIMK/NOPB  [MK06A]  48.26,27.94 180 top

### Tracks (layer width: path | path; a pad name or v marks a point on that pad's centre or on a via)
+3V3
  Top 0.152: BNO055_IMU1:C1.1 31.75,6.35 33.02,5.08 33.87,5.08 BNO055_IMU1:R2.2 | BNO055_IMU1:R2.2 BNO055_IMU1:R1.2 | BNO055_IMU1:R2.2 33.44,8.05 BNO055_IMU1:R4.2 36.69,12.14 36.69,13.47 36.82,13.6 37.02,13.6 BNO055_IMU1:U1.4 BNO055_IMU1:U1.3 37.25,14.34 37.45,14.34 37.58,14.47 37.58,15.47 BNO055_IMU1:U1.28 37.62,15.82 36.12,17.32 36.12,20.05 38.39,22.31 38.86,22.31 DC-DC_CONVERTER1:U1.2 DC-DC_CONVERTER1:U1.3 | 44.03,22.81 DC-DC_CONVERTER1:L1.1 44.03,22.91 BNO055_IMU1:C4.2 | 44.03,22.81 DC-DC_CONVERTER1:C1.2 | 44.03,22.81 43.95,22.81 42.88,21.73 40.53,21.73 DC-DC_CONVERTER1:U1.3 | DC-DC_CONVERTER1:U1.3 38.86,23.41 38.44,23.41 33.55,28.29 19.51,28.29 18.78,27.56 BNO055_IMU1:C3.1 | CONNECTORS1:DISPLAY.2 7.24,38.1 8.41,36.93 10.06,36.93 18.45,28.54 BNO055_IMU1:C3.1 | CONNECTORS1:DISPLAY.18 CONNECTORS1:DISPLAY.17 12.39,21.29 12.39,23.84 13.08,24.52 13.08,26.16 14.48,27.56 BNO055_IMU1:C3.1
  Bottom 0.152: CONNECTORS1:DISPLAY.2 6.35,55.88 6.95,56.48 6.95,72.04 CONNECTORS1:BT1.PWR@1
+5V  (via drill 0.35)
  Top 0.152: 36.94,40.1 40.44,40.1 41.16,39.37 MICROPHONES1:R3.1 40.86,38.74 v40.86,38.32 | 36.94,40.1 MICROPHONES1:U2.6 | MICROPHONES1:Q1.2 36.94,43.88 36.94,40.1 | MICROPHONES1:U2.6 MICROPHONES1:U2.5 | MICROPHONES1:R1.1 MICROPHONES1:R19.2 49.43,26.15 MICROPHONES1:U$1.1 48.97,27.45 48.72,27.45 48.59,27.58 48.59,31.66 MICROPHONES1:C10.1 48.85,34.12 48.85,36.3 49.03,36.48 49.33,36.48 MICROPHONES1:IC2.7 48.26,36.58 v48.01,36.32 | MICROPHONES1:R1.1 MICROPHONES1:R2.1 | MCU1:C1.1 22.44,39.37 v22.62,39.37 | v37.21,38.96 36.82,39.35 MICROPHONES1:U2.6 | MICROPHONES1:C14.1 12.7,23.71 12.7,19.05 13.97,17.78 DC-DC_CONVERTER1:C2.2 14.72,17.78 15.45,17.05 20.13,17.05 21.6,18.52 23.26,18.52 23.27,18.52 25.02,18.52 25.15,18.65 25.15,19.16 25.22,19.23 | 25.22,19.23 MCU1:U1.6 25.79,19.8 25.79,20.31 26.87,21.39 | MCU1:U1.18 24.99,11.32 24.99,11.83 25.22,12.06 25.22,19.23 | v27.94,24.74 27.94,22.47 26.87,21.39 | v27.94,26.67 DC-DC_CONVERTER1:R2.1 29.84,26.67 30.86,27.69 32,27.69 33.02,26.67 33.02,23.37 33.85,22.54 DC-DC_CONVERTER1:U1.7 34.8,22.76 35.23,22.76 35.56,23.09 v35.56,25.4 | MICROPHONES1:R1.1 v45.72,21.59 | 26.87,21.39 27.07,21.19 MCU1:U1.4
  Bottom 0.152: v48.01,36.32 44.96,36.32 42.96,38.32 v40.86,38.32 | v22.62,39.37 28.71,39.37 30.23,37.85 34.83,37.85 35.94,38.96 v37.21,38.96 | v27.94,24.74 v27.94,26.67 | v35.56,25.4 37.62,25.4 40.77,28.55 44.7,28.55 45.06,28.19 45.06,22.25 v45.72,21.59
BNO055_IMU1:I2C_ADDR_SEL
  Top 0.152: BNO055_IMU1:R3.2 42.42,9.82 42.42,13.1 41.92,13.6 41.72,13.6 BNO055_IMU1:U1.17
BNO055_IMU1:N$1  (via drill 0.35)
  Top 0.152: BNO055_IMU1:U1.27 38,15.63 38,15.87 36.85,17.02 BNO055_IMU1:Y1.P$2 36.85,19.32 v38.1,20.57 | BNO055_IMU1:C5.1 15.24,23.71 v15.24,24.13
  Bottom 0.152: v38.1,20.57 31.5,20.57 27.94,24.13 21.59,24.13 21.08,23.62 15.75,23.62 v15.24,24.13
BNO055_IMU1:N$2
  Top 0.152: BNO055_IMU1:U1.9 38.74,12.31 38.74,12.07 38.95,11.86 BNO055_IMU1:C2.1
BNO055_IMU1:N$3  (via drill 0.35)
  Top 0.152: BNO055_IMU1:U1.26 38.74,15.63 38.74,15.87 39.35,16.48 | BNO055_IMU1:Y1.P$1 39.35,16.48 | BNO055_IMU1:C6.1 15.24,21.17 v15.24,21.59 | v38.61,17.53 38.61,17.22 39.35,16.48
  Bottom 0.152: v38.61,17.53 33.27,17.53 29.21,21.59 v15.24,21.59
CONNECTORS1:N$1
  Bottom 0.152: CONNECTORS1:BT2.PWR@1 CONNECTORS1:BT1.GND@1
DC-DC_CONVERTER1:N$1  (via drill 0.35)
  Top 0.152: DC-DC_CONVERTER1:L1.2 41.92,22.86 v41.29,23.5 | v39.62,20.7 39.08,21.25 DC-DC_CONVERTER1:U1.1
  Bottom 0.152: v41.29,23.5 41.26,23.47 40.39,23.47 39.62,22.7 v39.62,20.7
DC-DC_CONVERTER1:N$2  (via drill 0.35)
  Top 0.152: DC-DC_CONVERTER1:R2.2 DC-DC_CONVERTER1:R1.1 31.33,24.32 v32.41,25.4 | DC-DC_CONVERTER1:U1.5 34.29,24.12 v34.29,25.4
  Bottom 0.152: v34.29,25.4 v32.41,25.4
GND  (via drill 0.35)
  Top 0.152: MICROPHONES1:R10.1 40.47,37.85 MICROPHONES1:U2.3 | MICROPHONES1:U2.3 MICROPHONES1:U2.2 | MICROPHONES1:U2.3 34.54,37.85 MICROPHONES1:U2.25 34.29,37.62 33.19,36.52 33.19,36.35 MICROPHONES1:U2.19 31.75,34.91 31.75,32.12 MICROPHONES1:C4.2 MICROPHONES1:C7.2 30.44,29.59 28.83,29.59 27.94,30.48 27.94,32.17 MICROPHONES1:C8.2 | MICROPHONES1:C6.2 41.49,40.74 42.27,39.97 42.27,38.77 41.49,38 MICROPHONES1:R10.1 | MICROPHONES1:L1.2 MICROPHONES1:C3.2 22.86,37.73 v22.86,36.83 20.74,36.83 MCU1:C1.2 | v26.67,34.29 27.09,33.87 MICROPHONES1:C8.2 | MICROPHONES1:C8.2 25.82,31.75 24.55,31.75 MICROPHONES1:C9.2 25.17,28.59 33.68,28.59 36.87,25.4 BNO055_IMU1:C4.1 40.77,23.84 39.66,23.84 | 54.63,38.08 MICROPHONES1:R12.2 57.78,41.24 57.78,43.4 MICROPHONES1:R7.1 | 54.63,38.08 54.13,37.58 MICROPHONES1:IC2.4 51.66,38.1 46.99,38.1 46.57,37.68 MICROPHONES1:C5.2 45.72,35.14 v45.72,35.56 | v52.07,34.29 51.65,33.87 MICROPHONES1:C10.2 52.07,33.02 v54.61,30.48 | v53.34,38.1 53.36,38.08 54.63,38.08 | MICROPHONES1:R18.1 MICROPHONES1:C13.1 54.19,27.09 v53.34,27.94 | v50.8,27.94 MICROPHONES1:U$1.2 | CONNECTORS1:MIC2.1 51.07,2.54 47.26,2.54 CONNECTORS1:MIC1.1 44.45,3.81 v41.91,6.35 | v42.57,36.83 MICROPHONES1:R10.1 | MCU1:C2.1 MCU1:C1.2 | MCU1:U1.21 27.07,7.61 BNO055_IMU1:C1.2 v29.72,7.74 v29.72,7.75 | v35.56,7.62 35.98,7.62 BNO055_IMU1:R3.1 BNO055_IMU1:C2.2 | BNO055_IMU1:C2.2 37.25,12.06 37.24,12.07 37.24,12.31 BNO055_IMU1:U1.6 37.24,12.55 37.24,12.79 37.37,12.93 | 39,15.14 39,15.39 BNO055_IMU1:U1.25 39.12,15.82 40.08,16.78 40.08,18.07 DC-DC_CONVERTER1:C1.1 41.45,20.32 v40.64,21.12
  Top 0.152: 39,15.14 38.56,14.71 v38.19,14.71 | v35.56,15.24 36.62,15.24 BNO055_IMU1:U1.2 | v40.64,22.86 39.66,23.84 | 39.66,23.84 DC-DC_CONVERTER1:U1.4 39.03,23.84 v37.97,24.89 | DC-DC_CONVERTER1:C2.1 BNO055_IMU1:C6.2 | BNO055_IMU1:C6.2 BNO055_IMU1:C5.2 MICROPHONES1:C14.2 MCU1:C3.1 20.15,27.35 BNO055_IMU1:C3.2 26.2,27.56 DC-DC_CONVERTER1:R1.2 31.88,21.89 DC-DC_CONVERTER1:U1.8 35.85,21.89 v36.83,22.86 | BNO055_IMU1:U1.18 41.52,14.14 v40.64,14.14 39.43,12.93 39.37,12.93 39.24,12.79 39.24,12.55 BNO055_IMU1:U1.10 39,12.55 39,12.79 | 39,12.79 38.87,12.93 37.37,12.93 | 39,12.79 39,13.48 38.76,13.72 38.76,14.22 39,14.46 39,15.14 | BNO055_IMU1:U1.5 37.37,12.98 37.37,12.93 | CONNECTORS1:DISPLAY.1 MCU1:C1.2 | CONNECTORS1:DISPLAY.20 CONNECTORS1:DISPLAY.19 v11.43,15.24 | v17.78,17.78 16.09,19.47 BNO055_IMU1:C6.2 | v39.37,7.62 38.52,7.62 BNO055_IMU1:C2.2 | v6.35,59.69 8.89,57.15 v8.89,54.61
  Bottom 0.152: v22.86,36.83 24.13,36.83 v26.67,34.29 | v52.07,34.29 52.07,36.83 v53.34,38.1 | v50.8,27.94 v53.34,27.94 54.61,29.21 v54.61,30.48 | v45.72,35.56 43.84,35.56 v42.57,36.83 | v29.72,7.75 35.43,7.75 v35.56,7.62 | v38.19,14.71 36.09,14.71 v35.56,15.24 | v40.64,21.12 v40.64,22.86 | v36.83,22.86 37.97,24 v37.97,24.89 | v40.64,14.14 40.64,14.09 41.25,13.48 41.25,12.98 40.64,12.37 v40.64,11.43 | v11.43,15.24 15.24,15.24 v17.78,17.78 | v41.91,6.35 40.64,6.35 v39.37,7.62 | CONNECTORS1:BT2.GND@1 5.33,58.68 v6.35,59.69 | v8.89,54.61 CONNECTORS1:DISPLAY.1
  pour Top: 0,0 60.96,0 60.96,86.36 0,86.36
MCU1:N$1  (via drill 0.35)
  Top 0.152: MCU1:U1.7 24.99,19.8 24.99,20.31 25.28,20.61 MCU1:Y1.3 25.28,24.16 24.5,24.93 24.5,25.03 v24.13,25.4 | v21.59,40.64 21.17,41.06 MCU1:C2.2
  Bottom 0.152: v24.13,25.4 21.59,27.94 v21.59,40.64
MCU1:N$2
  Top 0.152: MCU1:U1.8 23.76,19.59 23.76,23.32 22.98,24.1 MCU1:Y1.1 20.48,25.98 MCU1:C3.2
MICROPHONES1:N$1  (via drill 0.35)
  Top 0.152: MICROPHONES1:R3.2 39.58,39.16 | 39.58,39.16 38.77,38.35 MICROPHONES1:U2.4 | MICROPHONES1:U2.8 MICROPHONES1:U2.9 | MICROPHONES1:U2.9 MICROPHONES1:U2.10 MICROPHONES1:U2.11 | MICROPHONES1:C6.1 v38.1,41.91 | v38.1,39.37 39.37,39.37 39.58,39.16 | MICROPHONES1:U2.9 34.29,40.25 v34.29,41.91
  Bottom 0.152: v38.1,41.91 v38.1,39.37 35.56,41.91 v34.29,41.91
MICROPHONES1:N$2  (via drill 0.35)
  Top 0.152: MICROPHONES1:C7.1 29.63,31.51 v31.14,33.02 | v32.83,34.29 33.13,34.59 33.13,35.05 34.04,35.96 MICROPHONES1:U2.21
  Bottom 0.152: v31.14,33.02 32.41,34.29 v32.83,34.29
MICROPHONES1:N$3  (via drill 0.35)
  Top 0.152: MICROPHONES1:U2.18 31.1,35.56 v30.48,35.56 | v26.67,31.75 25.41,30.48 MICROPHONES1:C9.1
  Bottom 0.152: v30.48,35.56 v26.67,31.75
MICROPHONES1:N$4
  Top 0.152: MICROPHONES1:Q1.1 35.54,44.38 MICROPHONES1:U2.7
MICROPHONES1:N$5
  Top 0.152: MICROPHONES1:Q1.3 39.54,46.82 43.18,43.18 43.18,35.93 MICROPHONES1:L2.1 MICROPHONES1:C5.1
MICROPHONES1:N$6
  Top 0.152: MICROPHONES1:U2.24 MICROPHONES1:U2.1 37.18,36.85 MICROPHONES1:L2.2 39.49,34.04 MICROPHONES1:D1.A
MICROPHONES1:N$7
  Top 0.152: MICROPHONES1:IC2.3 52.27,36.98 52.57,36.98 52.72,36.83 MICROPHONES1:R15.1 MICROPHONES1:R16.1
MICROPHONES1:N$8
  Top 0.152: MICROPHONES1:U2.17 30.58,37.35 MICROPHONES1:R5.2 MICROPHONES1:C8.1
MICROPHONES1:N$9
  Top 0.152: MICROPHONES1:U2.16 29.38,37.85 MICROPHONES1:R5.1 MICROPHONES1:R13.2 MICROPHONES1:C11.1
MICROPHONES1:N$10  (via drill 0.35)
  Top 0.152: MICROPHONES1:R12.1 58.04,38.48 59.05,37.47 59.05,36.83 59.03,36.8 59.03,36.58 58.42,35.97 v58.42,35.92 | v53.49,36.07 53.04,36.52 52.6,36.52 52.54,36.58 MICROPHONES1:IC2.2 52.27,36.48 52.57,36.48 52.75,36.3 52.75,34.46 MICROPHONES1:R17.2
  Bottom 0.152: v53.49,36.07 53.64,35.92 v58.42,35.92
MICROPHONES1:N$11
  Top 0.152: MICROPHONES1:U2.14 MICROPHONES1:U2.13 29.95,41.79 MICROPHONES1:D2.C 27.82,41.91 MICROPHONES1:L1.1
MICROPHONES1:N$12  (via drill 0.35)
  Top 0.152: MICROPHONES1:R9.2 36.41,34.29 v36.83,34.29 | v38.1,36.83 MICROPHONES1:R10.2
  Bottom 0.152: v36.83,34.29 36.83,35.56 v38.1,36.83
MICROPHONES1:N$13  (via drill 0.35)
  Top 0.152: MICROPHONES1:U2.22 34.39,36.05 34.39,35.88 33.44,34.93 MICROPHONES1:R9.1 33.02,32.6 v33.02,31.75 | MICROPHONES1:C12.2 46.14,42.91 MICROPHONES1:R6.1 44.36,39.37 v43.79,39.37
  Bottom 0.152: v43.79,39.37 43.34,38.93 40.61,38.93 40.25,38.57 40.25,36.85 35.15,31.75 v33.02,31.75
MICROPHONES1:N$14
  Top 0.152: MICROPHONES1:R8.1 56.73,45.82 59.36,43.19 59.36,27.61 54.19,22.44 MICROPHONES1:C1.2
MICROPHONES1:N$15  (via drill 0.35)
  Top 0.152: MICROPHONES1:C2.1 58,22.86 v58.42,22.86 | v55.88,40.64 55.88,41.06 MICROPHONES1:R11.1
  Bottom 0.152: v58.42,22.86 58.42,30.05 59.03,30.66 59.03,37.49 v55.88,40.64
MICROPHONES1:N$16
  Top 0.152: MICROPHONES1:R7.2 MICROPHONES1:R11.2 53.49,41.91 52.57,42.83 52.27,42.83 MICROPHONES1:IC1.2
MICROPHONES1:N$17
  Top 0.152: MICROPHONES1:R8.2 MICROPHONES1:R4.1 52.75,45.89 52.75,43.71 52.57,43.53 52.27,43.53 MICROPHONES1:IC1.3
MICROPHONES1:N$18  (via drill 0.35)
  Top 0.152: 49.03,43.53 49.33,43.53 MICROPHONES1:IC1.6 49.13,43.43 49.03,43.53 | MICROPHONES1:R4.2 48.85,45.89 48.85,43.86 | MICROPHONES1:R15.2 v58.42,36.83 | v48.26,44.45 48.85,43.86 | 48.85,43.86 48.85,43.71 49.03,43.53
  Bottom 0.152: v58.42,36.83 50.8,44.45 v48.26,44.45
MICROPHONES1:N$19  (via drill 0.35)
  Top 0.152: MICROPHONES1:R17.1 MICROPHONES1:R14.2 53.34,30.06 v53.34,30.48 | v47.18,35.56 47.4,35.78 47.4,36.57 47.91,37.08 MICROPHONES1:IC2.6
  Bottom 0.152: v53.34,30.48 48.26,35.56 v47.18,35.56
MICROPHONES1:N$20
  Top 0.152: MICROPHONES1:U$1.3 52.17,28.89 MICROPHONES1:R14.1 MICROPHONES1:C13.2
MICROPHONES1:N$21  (via drill 0.35)
  Top 0.152: MICROPHONES1:R19.1 MICROPHONES1:R18.2 52.49,24.55 v53.34,25.4 | MICROPHONES1:R16.2 57.62,34.29 v58.42,34.29
  Bottom 0.152: v58.42,34.29 58.42,30.48 v53.34,25.4
MICROPHONES1:VNEG  (via drill 0.35)
  Top 0.152: MICROPHONES1:C3.1 25.21,38.28 | 25.21,38.28 26.42,39.49 MICROPHONES1:D2.A 31.08,39.49 32.07,38.5 32.24,38.5 MICROPHONES1:U2.15 32.28,38.46 v30.48,38.46 | MICROPHONES1:C11.2 MICROPHONES1:R13.1 25.21,37.49 25.21,38.28 | MICROPHONES1:IC1.4 50.39,45.72 v49.53,45.72
  Bottom 0.152: v30.48,38.46 33.68,41.66 33.68,42.16 37.24,45.72 v49.53,45.72
MICROPHONES1:VPOS  (via drill 0.35)
  Top 0.152: MICROPHONES1:U2.23 35.04,34.29 34.36,33.62 34.36,32.42 35.19,31.6 MICROPHONES1:C4.1 40.52,30.48 MICROPHONES1:D1.C 41.91,31.75 v43.18,33.02 | MICROPHONES1:IC1.7 49.33,43.03 49.03,43.03 48.88,43.18 MICROPHONES1:C12.1 47.84,42.91 MICROPHONES1:R6.2 43.48,36.79 43.48,35.8 43.33,35.65 v43.33,35.22
  Bottom 0.152: v43.33,35.22 43.33,33.17 v43.18,33.02
N$3  (via drill 0.35)
  Top 0.152: CONNECTORS1:DISPLAY.3 16.28,28.17 v16.51,28.17 | v17.14,24.26 20.07,21.34 v20.07,18.41 | v20.32,12.63 20.51,12.45 MCU1:U1.16
  Bottom 0.152: v16.51,28.17 17.14,27.53 v17.14,24.26 | v20.07,18.41 20.32,18.16 v20.32,12.63
N$4
  Top 0.152: CONNECTORS1:DISPLAY.6 4.83,31.5 4.83,14.86 6.45,13.24 MCU1:U1.15
N$5
  Top 0.152: CONNECTORS1:DISPLAY.4 4.45,33.66 4.45,14.61 8.05,11 MCU1:U1.17
N$6  (via drill 0.35)
  Top 0.152: CONNECTORS1:DISPLAY.5 11.43,30.48 v12.7,30.48 | v12.7,17.78 16.44,14.04 MCU1:U1.14
  Bottom 0.152: v12.7,30.48 v12.7,17.78
N$7  (via drill 0.35)
  Top 0.152: CONNECTORS1:DISPLAY.7 10.77,30.48 v13.31,27.94 | v19.05,16.45 19.11,16.45 20.72,14.84 MCU1:U1.13
  Bottom 0.152: v13.31,27.94 13.31,22.66 14.99,20.98 17.12,20.98 19.05,19.05 v19.05,16.45
N$8  (via drill 0.35)
  Top 0.152: MICROPHONES1:C1.1 49.53,21.59 | 49.53,21.59 MICROPHONES1:R1.2 | v50.8,20.32 49.53,21.59
  Bottom 0.152: CONNECTORS1:MIC1.2 47.99,14.97 50.8,17.78 v50.8,20.32
N$9
  Top 0.152: MICROPHONES1:R2.2 MICROPHONES1:C2.2 54.34,17.2 CONNECTORS1:MIC2.2
N$11  (via drill 0.35)
  Top 0.152: v36.82,21.6 36.82,21.55 31.88,16.61 31.88,16.09 31.74,15.96 31.23,15.96 MCU1:U1.29 | v44.45,27.94 45.4,28.89 MICROPHONES1:U$1.4
  Bottom 0.152: v36.82,21.6 43.16,27.94 v44.45,27.94
N$12  (via drill 0.35)
  Top 0.152: BNO055_IMU1:R2.1 31.75,8.04 31.75,10.29 29.95,12.09 29.95,14.39 30.08,14.52 30.59,14.52 MCU1:U1.28 31.23,15.16 31.74,15.16 31.83,15.24 v34.29,15.24 | BNO055_IMU1:U1.20 41.89,15.24 v43.18,15.24 43.18,17.78 45.11,19.71 45.11,26.21 46.39,27.48 46.64,27.48 MICROPHONES1:U$1.5
  Bottom 0.152: v43.18,15.24 38.51,15.24 37.91,15.85 35.31,15.85 34.7,15.24 v34.29,15.24
N$13  (via drill 0.35)
  Top 0.152: MCU1:U1.27 30.98,13.97 v35.56,13.97 | BNO055_IMU1:R1.1 34.33,2.92 36.2,2.92 38.61,5.33 39.62,5.33 42.72,8.43 42.72,13.79 41.92,14.6 41.72,14.6 BNO055_IMU1:U1.19 | v39.37,13.97 40.15,14.75 40.89,14.75 40.92,14.72 BNO055_IMU1:U1.19 | BNO055_IMU1:U1.19 42.84,14.72 42.93,14.63 43.43,14.63 45.72,16.92 v45.72,20.32 | v45.72,25.4 47.09,26.77 MICROPHONES1:U$1.6
  Bottom 0.152: v39.37,13.97 v35.56,13.97 | v45.72,20.32 45.72,20.73 46.33,21.34 46.33,21.84 45.72,22.45 v45.72,25.4
N$14  (via drill 0.35)
  Top 0.152: MCU1:U1.25 35.3,12.44 v35.56,12.7 | v40.64,13.23 41.12,12.75 BNO055_IMU1:U1.14
  Bottom 0.152: v35.56,12.7 40.11,12.7 v40.64,13.23
N$15  (via drill 0.35)
  Top 0.152: BNO055_IMU1:R4.1 36.2,9.95 v36.2,10.16 | v39.56,11.43 39.56,12.37 BNO055_IMU1:U1.11 | v33.02,13.05 31.11,13.05 MCU1:U1.26
  Bottom 0.152: v36.2,10.16 37.47,11.43 | 37.47,11.43 v39.56,11.43 | v33.02,13.05 34.35,13.05 35.31,12.09 36.8,12.09 37.47,11.43